# EAGLE design Relay (EAGLE 6.4)
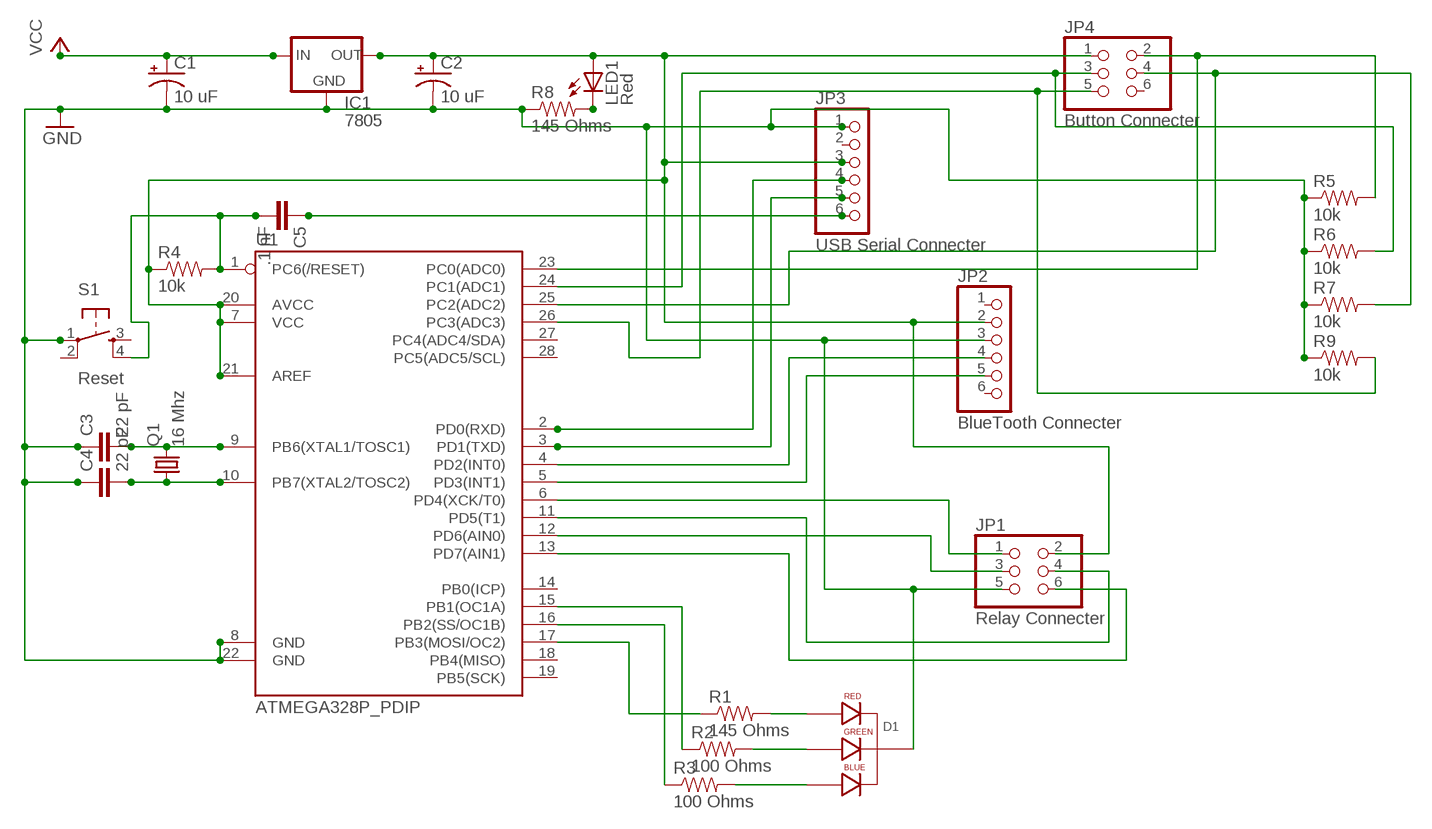
[diagram p0: schematic, sheet 1]

## Parts
C1  10 uF  CAP_POLPTH2  [CPOL-RADIAL-10UF-25V]
C2  10 uF  CAP_POLPTH2  [CPOL-RADIAL-10UF-25V]
C3  22 pF  CAPPTH2  [CAP-PTH-SMALL2]
C4  22 pF  CAPPTH2  [CAP-PTH-SMALL2]
C5  .1 nF  CAPPTH2  [CAP-PTH-SMALL2]
D1  LED-RGB-CC-THRUCLEAR  [LED-RGB-THRU]
IC1  7805  78XXS  [78XXS]
JP1  Relay Connecter  PINHD-2X3  [2X03]
JP2  BlueTooth Connecter  PINHD-1X6  [1X06]
JP3  USB Serial Connecter  PINHD-1X6  [1X06]
JP4  Button Connecter  PINHD-2X3  [2X03]
LED1  Red  LED3MM  [LED3MM]
Q1  16 Mhz  CRYSTALHC49S  [HC49/S]
R1  145 Ohms  RESISTORPTH-1/4W  [AXIAL-0.4]
R2  100 Ohms  RESISTORPTH-1/4W  [AXIAL-0.4]
R3  100 Ohms  RESISTORPTH-1/4W  [AXIAL-0.4]
R4  10k  10KOHM1/10W1%(0603)  [0402-RES]
R5  10k  10KOHM1/10W1%(0603)  [0402-RES]
R6  10k  10KOHM1/10W1%(0603)  [0402-RES]
R7  10k  10KOHM1/10W1%(0603)  [0402-RES]
R8  145 Ohms  RESISTORPTH-1/4W  [AXIAL-0.4]
R9  10k  10KOHM1/10W1%(0603)  [0402-RES]
S1  Reset  TAC_SWITCHPTH  [TACTILE-PTH]
U1  ATMEGA328P_PDIP  [DIL28-3]

## Nets
GND: C1.2(-) C2.2(-) C3.1 C4.1 D1.2(CATHODE) IC1.GND JP1.5 JP2.3 JP3.1 R5.1 R6.1 R7.1 R8.P$1 R9.1 S1.1 U1.8(GND) U1.22(GND)
N$1: C2.1(+) IC1.OUT JP1.2 JP2.2 JP3.3 JP4.1 LED1.A R4.1 U1.7(VCC) U1.20(AVCC) U1.21(AREF)
N$2: LED1.K(C) R8.P$2
N$3: C5.2 R4.2 S1.4 U1.1(PC6(/RESET))
N$4: C3.2 Q1.2 U1.9(PB6(XTAL1/TOSC1))
N$5: C4.2 Q1.1 U1.10(PB7(XTAL2/TOSC2))
N$6: JP3.4 U1.2(PD0(RXD))
N$7: JP3.5 U1.3(PD1(TXD))
N$9: JP2.4 U1.4(PD2(INT0))
N$10: JP2.5 U1.5(PD3(INT1))
N$11: JP1.1 U1.6(PD4(XCK/T0))
N$12: JP1.4 U1.11(PD5(T1))
N$13: JP1.3 U1.12(PD6(AIN0))
N$14: JP1.6 U1.13(PD7(AIN1))
N$15: D1.1(RED_CATHODE) R1.P$2
N$16: D1.3(GREEN_CATHODE) R2.P$2
N$17: D1.4(BLUE_CATHODE) R3.P$2
N$18: R1.P$1 U1.17(PB3(MOSI/OC2))
N$19: R2.P$1 U1.15(PB1(OC1A))
N$20: R3.P$1 U1.16(PB2(SS/OC1B))
N$21: JP4.2 R5.2 U1.23(PC0(ADC0))
N$22: JP4.3 R6.2 U1.24(PC1(ADC1))
N$23: JP4.4 R7.2 U1.25(PC2(ADC2))
N$24: JP4.5 R9.2 U1.26(PC3(ADC3))
N$25: C5.1 JP3.6
VCC: C1.1(+) IC1.IN
Unconnected: JP2.1 JP2.6 JP3.2 JP4.6 S1.2 S1.3 U1.14(PB0(ICP)) U1.18(PB4(MISO)) U1.19(PB5(SCK)) U1.27(PC4(ADC4/SDA)) U1.28(PC5(ADC5/SCL))

## Library data of the parts
C1 C2 = SparkFun-Capacitors:CAP_POL: Capacitor Polarized These are standard SMD and PTH capacitors. Normally 10uF, 47uF, and 100uF in electrolytic and tantalum varieties. Always verify the external diameter of the through hole cap, it varies with capacity, voltage, and manufacturer. The EIA devices should be standard.
C3-C5 = SparkFun-Capacitors:CAP: Capacitor Standard 0603 ceramic capacitor, and 0.1" leaded capacitor.
D1 = SparkFun-LED:LED-RGB-CC-THRU: RGB Through-hole common cathode LED SparkFun Storefront: COM-00105 (Clear) COM-09264 (Diffuse); PROD_ID: DIO-08418
IC1 = v-reg:78XXS: VOLTAGE REGULATOR
JP1 JP4 = SparkFun-Connectors:PINHD-2X3: PIN HEADER
JP2 JP3 = pinhead:PINHD-1X6: PIN HEADER
LED1 = led:LED: LED OSRAM: - CHIPLED LG R971, LG N971, LY N971, LG Q971, LY Q971, LO R971, LY R971 LH N974, LH R974 LS Q976, LO Q976, LY Q976 LO Q996 - Hyper CHIPLED LW Q18S LB Q993, LB Q99A, LB R99A - SideLED LS A670, LO A670, LY A670, LG A670, LP A670 LB A673, LV A673, LT A673, LW A673 LH A674 LY A675 LS A676, LA A676, LO A676, LY A676, LW A676 LS A679, LY A679, LG A679 - Hyper Micro SIDELED® LS Y876, LA Y876, LO Y876, LY Y876 LT Y87S - SmartLED LW L88C, LW L88S LB L89C, LB L89S, LG L890 LS L89K, LO L89K, LY L89K LS L896, LA L896, LO L896, LY L896 - TOPLED LS T670, LO T670, LY T670, LG T670, LP T670 LSG T670, LSP T670, LSY T670, LOP T670, LYG T670 LG T671, LOG T671, LSG T671 LB T673, LV T673, LT T673, LW T673 LH T674 LS T676, LA T676, LO T676, LY T676, LB T676, LH T676, LSB T676, LW T676 LB T67C, LV T67C, LT T67C, LS T67K, LO T67K, LY T67K, LW E67C LS E67B, LA E67B, LO E67B, LY E67B, LB E67C, LV E67C, LT E67C LW T67C LS T679, LY T679, LG T679 LS T770, LO T770, LY T770, LG T770, LP T770 LB T773, LV T773, LT T773, LW T773 LH T774 LS E675, LA E675, LY E675, LS T675 LS T776, LA T776, LO T776, LY T776, LB T776 LHGB T686 LT T68C, LB T68C - Hyper Mini TOPLED® LB M676 - Mini TOPLED Santana® LG M470 LS M47K, LO M47K, LY M47K Source: http://www.osram.convergy.de LUXEON: - LUMILED® LXK2-PW12-R00, LXK2-PW12-S00, LXK2-PW14-U00, LXK2-PW14-V00 LXK2-PM12-R00, LXK2-PM12-S00, LXK2-PM14-U00 LXK2-PE12-Q00, LXK2-PE12-R00, LXK2-PE12-S00, LXK2-PE14-T00, LXK2-PE14-U00 LXK2-PB12-K00, LXK2-PB12-L00, LXK2-PB12-M00, LXK2-PB14-N00, LXK2-PB14-P00, LXK2-PB14-Q00 LXK2-PR12-L00, LXK2-PR12-M00, LXK2-PR14-Q00, LXK2-PR14-R00 LXK2-PD12-Q00, LXK2-PD12-R00, LXK2-PD12-S00 LXK2-PH12-R00, LXK2-PH12-S00 LXK2-PL12-P00, LXK2-PL12-Q00, LXK2-PL12-R00 Source: www.luxeon.com KINGBRIGHT: KA-3528ASYC Source: www.kingbright.com
Q1 = crystal:CRYSTAL: CRYSTAL; OC_FARNELL: 1667008; OC_NEWARK: unknown
R1-R3 R8 = SparkFun-Resistors:RESISTOR: Resistor Basic schematic elements and footprints for 0603, 1206, and PTH resistors.
R4-R7 R9 = SparkFun-Resistors:10KOHM1/10W1%(0603): RES-00824; PROD_ID: RES-00824
S1 = SparkFun-Electromechanical:TAC_SWITCH: Momentary Switch Button commonly used for reset or general input. Spark Fun Electronics SKU : COM-00097 SMT- SWCH-08247
U1 = SparkFun-DigitalIC:ATMEGA328P_PDIP: uC used in the Arduino 32kb flash, 1k EEPROM, 2k SRAM This is the through-hole version of this chip.

## Board
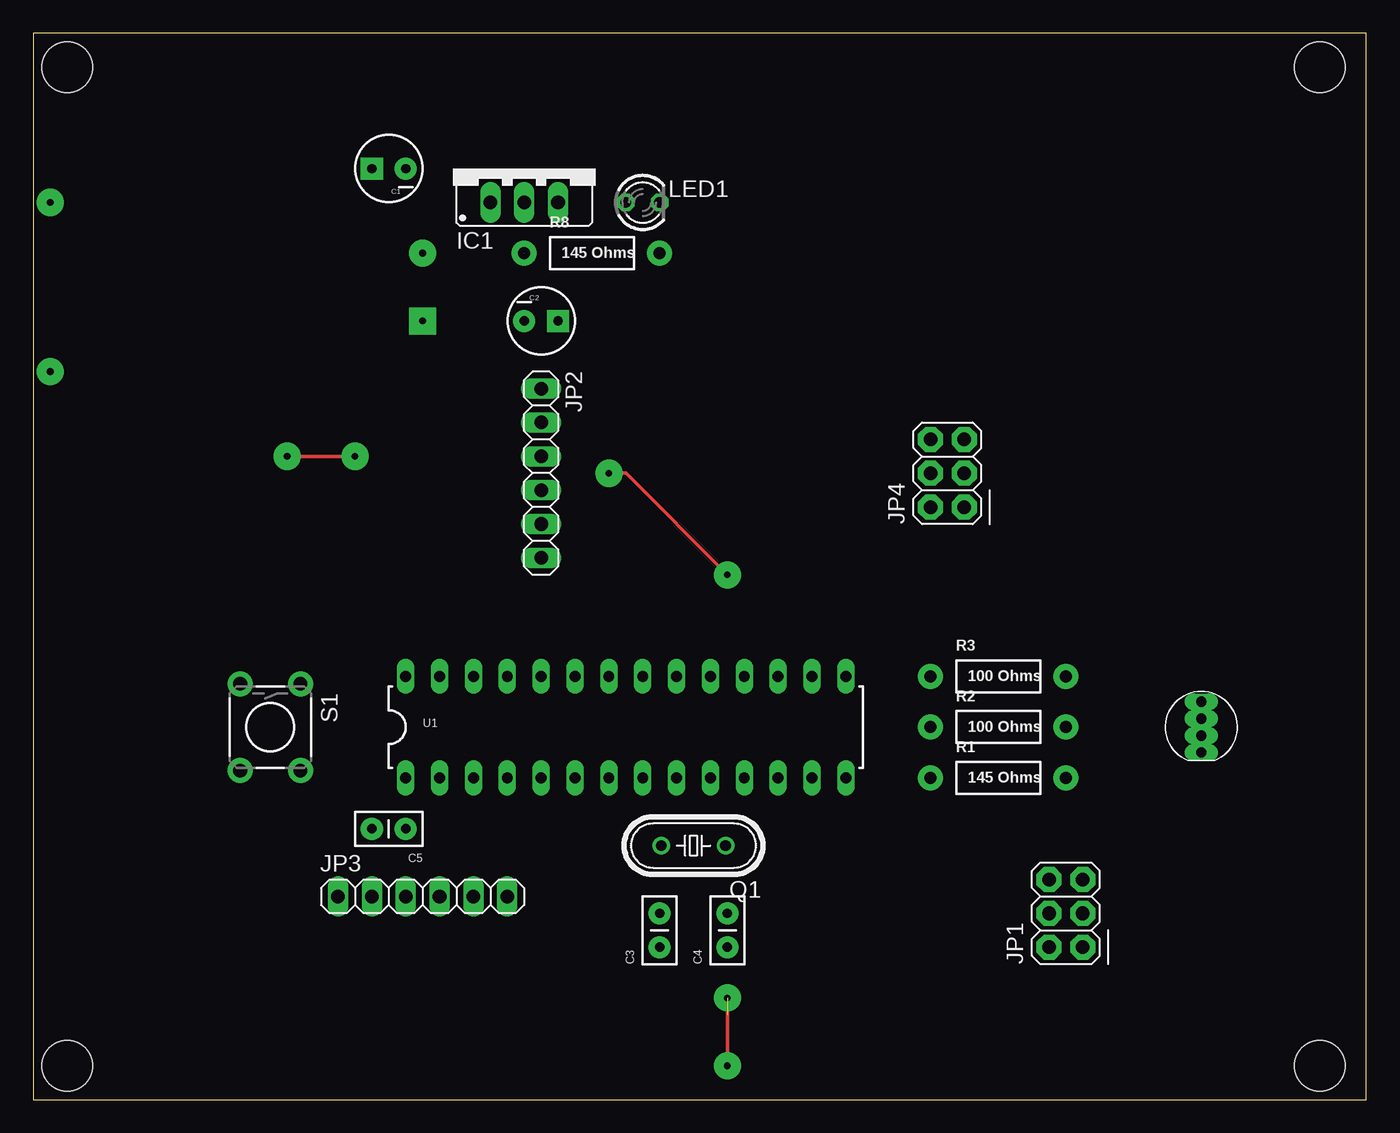
[diagram p1: board, top side]
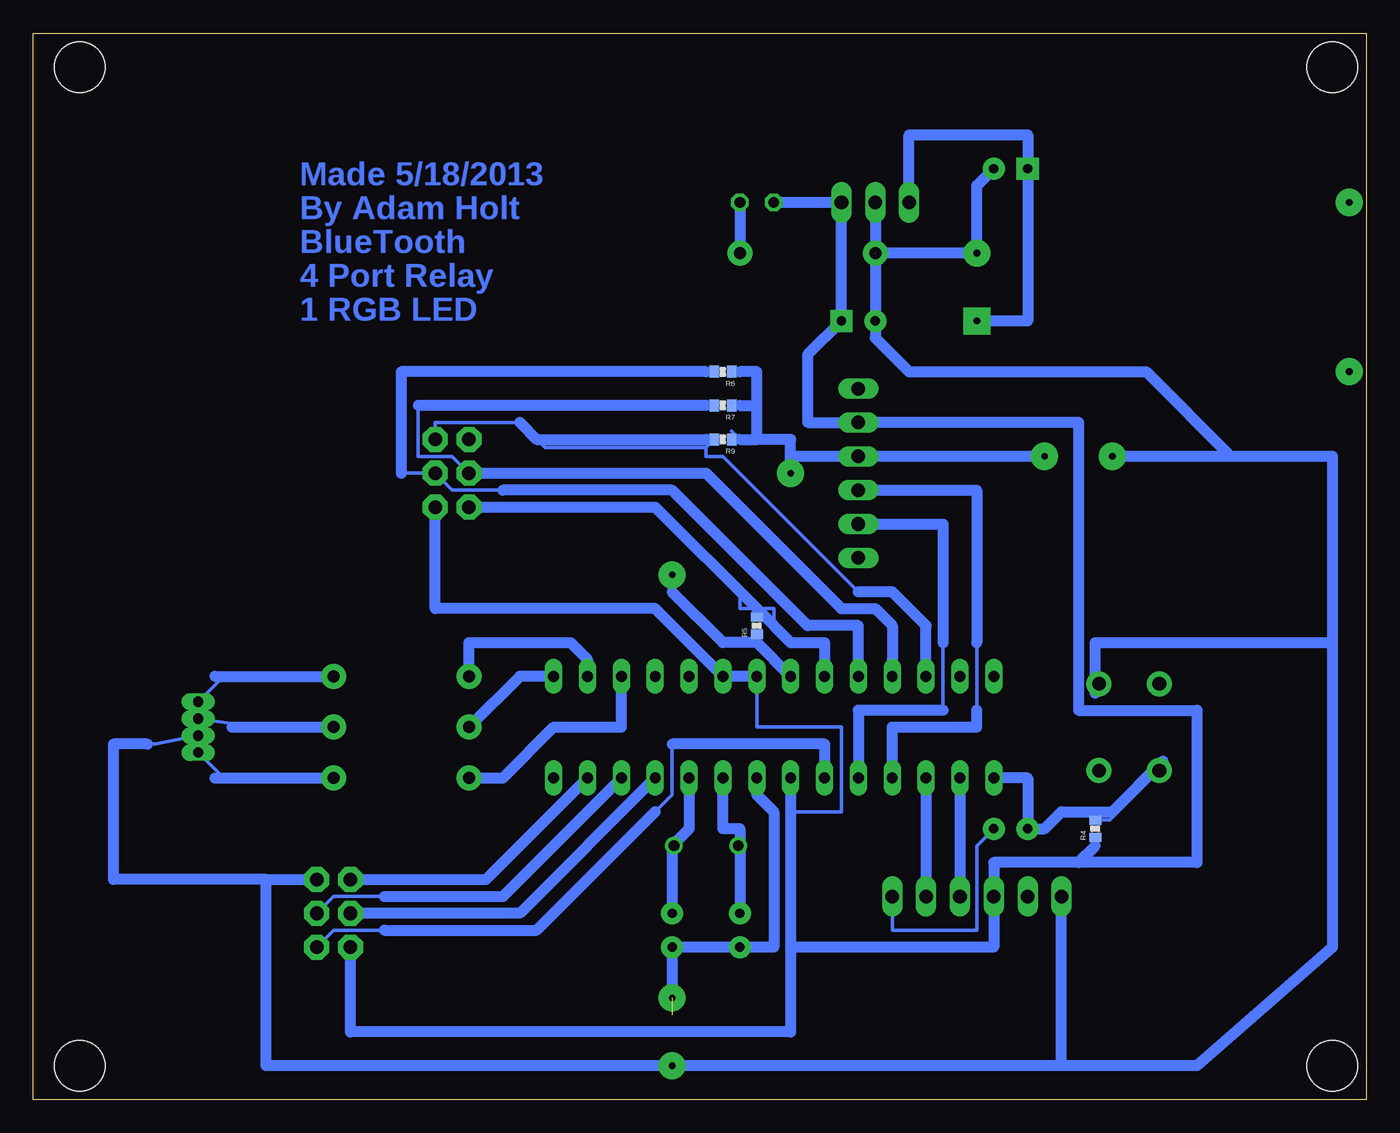
[diagram p2: board, bottom side, seen from below]

Size 100 x 80 mm. Coordinates in mm from the lower left corner, seen from the top.
Outline: 0,0 100,0 100,80 0,80 0,0
Copper layers (1*16): Top 0.035mm / dielectric 1.5mm / Bottom 0.035mm
Design rules "default": minimum track width 10mil, minimum drill 24mil, track to track 8mil, track to pad 8mil, pad to pad 8mil, via to via 8mil, smd to smd 8mil, copper to edge 40mil, drill to drill 8mil, minimum pad ring 10mil, minimum via ring 8mil, stop-mask expansion 4mil, vias tented up to drill 0mil, thermal gap 10mil
Holes 3.81 mm at 2.54,77.47 96.52,77.47 96.52,2.54 2.54,2.54

### Footprints (pad centres in the part's own frame; a part is rotated, then mirrored left to right if it is on the bottom)
CPOL-RADIAL-10UF-25V = drill 0.7 pad 1.651 square: 1 1.27,0 | drill 0.7 pad 1.651: 2 -1.27,0
CAP-PTH-SMALL2 = drill 0.7 pad 1.651: 1 0,0; 2 2.54,0
LED-RGB-THRU = drill 0.762 pad 0.889 long: 1 1.905,0; 2 0.635,0; 3 -0.635,0; 4 -1.905,0
78XXS = drill 1.016 long: GND 0,-2.54; IN -2.54,-2.54; OUT 2.54,-2.54
2X03 = drill 1.016 pad 1.88 octagon: 1 -2.54,-1.27; 2 -2.54,1.27; 3 0,-1.27; 4 0,1.27; 5 2.54,-1.27; 6 2.54,1.27
1X06 = drill 1.016 long: 1 -6.35,0; 2 -3.81,0; 3 -1.27,0; 4 1.27,0; 5 3.81,0; 6 6.35,0
LED3MM = drill 0.813 octagon: A -1.27,0; K 1.27,0
HC49/S = drill 0.813: 1 -2.413,0; 2 2.413,0
AXIAL-0.4 = drill 0.9 pad 1.88: P$1 -5.08,0; P$2 5.08,0
0402-RES = smd 0.7 x 0.9: 1 -0.65,0; 2 0.65,0
TACTILE-PTH = drill 1.016 pad 1.88: 1 -3.251,2.261; 2 3.251,2.261; 3 -3.251,-2.261; 4 3.251,-2.261
DIL28-3 = drill 0.813 long: 1 -16.51,-3.81; 2 -13.97,-3.81; 3 -11.43,-3.81; 4 -8.89,-3.81; 5 -6.35,-3.81; 6 -3.81,-3.81; 7 -1.27,-3.81; 8 1.27,-3.81; 9 3.81,-3.81; 10 6.35,-3.81; 11 8.89,-3.81; 12 11.43,-3.81; 13 13.97,-3.81; 14 16.51,-3.81; 15 16.51,3.81; 16 13.97,3.81; 17 11.43,3.81; 18 8.89,3.81; 19 6.35,3.81; 20 3.81,3.81; 21 1.27,3.81; 22 -1.27,3.81; 23 -3.81,3.81; 24 -6.35,3.81; 25 -8.89,3.81; 26 -11.43,3.81; 27 -13.97,3.81; 28 -16.51,3.81

### Placement (x,y rotation side)
C1  26.67,69.85 180 top
C2  38.1,58.42 0 top
C3  46.99,11.43 90 top
C4  52.07,11.43 90 top
C5  27.94,20.32 180 top
D1  87.63,27.94 270 top
IC1  36.83,69.85 0 top
JP1  77.47,13.97 90 top
JP2  38.1,46.99 270 top
JP3  29.21,15.24 0 top
JP4  68.58,46.99 90 top
LED1  45.72,67.31 0 top
Q1  49.53,19.05 180 top
R1  72.39,24.13 0 top
R2  72.39,27.94 0 top
R3  72.39,31.75 0 top
R4  20.32,20.32 90 bottom
R5  45.72,35.56 90 bottom
R6  48.26,54.61 180 bottom
R7  48.26,52.07 180 bottom
R8  41.91,63.5 0 top
R9  48.26,49.53 180 bottom
S1  17.78,27.94 270 top
U1  44.45,27.94 0 top

### Tracks (layer width: path | path; a pad name or v marks a point on that pad's centre or on a via)
GND  (via drill 0.51 pad 2.03)  (2 unrouted)
  Top 0.254: v24.13,48.26 v19.05,48.26 | v52.07,2.54 v52.07,7.62 | v43.18,46.99 44.45,46.99 v52.07,39.37
  Bottom 0.254: S1.1 20.04,34.01 20.32,34.29 | 91.44,26.67 90.81,26.67 D1.2 | R9.1 46.99,49.53 47.61,50.15 | 40.64,48.26 JP2.3 | R7.1 46.99,52.07 | R6.1 46.99,54.61 | R5.1 45.72,34.29 | v52.07,39.37 52.07,38.1 | 43.18,48.26 43.18,49.53
  Bottom 0.813: 10.16,48.26 2.54,48.26 2.54,34.29 | 10.16,48.26 v19.05,48.26 | v24.13,48.26 JP2.3 43.18,48.26 v43.18,46.99 43.18,49.53 45.72,49.53 | 46.99,49.53 45.72,49.53 | 45.72,49.53 45.72,52.07 | 46.99,52.07 45.72,52.07 | 45.72,52.07 45.72,54.61 46.99,54.61 | 20.32,30.48 20.32,34.29 2.54,34.29 | 2.54,34.29 2.54,11.43 12.7,2.54 22.86,2.54 | 22.86,2.54 JP3.1 | 22.86,2.54 v52.07,2.54 82.55,2.54 82.55,16.51 | 82.55,16.51 JP1.5 | U1.8 45.72,22.86 44.45,21.59 44.45,11.43 C3.1 C4.1 v52.07,7.62 | 82.55,16.51 93.98,16.51 93.98,26.67 91.44,26.67 | U1.22 45.72,34.29 48.26,34.29 52.07,38.1 | IC1.GND R8.P$1 | R8.P$1 C2.2 36.83,57.15 34.29,54.61 16.51,54.61 10.16,48.26 | C1.2 29.21,68.58 v29.21,63.5 R8.P$1
N$1
  Bottom 0.254: 27.94,17.78 JP3.3 27.94,11.43 | R4.1 20.32,19.05 | 43.18,11.43 43.18,21.59 | 43.18,21.59 U1.7 | U1.21 45.72,27.94 39.37,27.94 39.37,21.59 43.18,21.59
  Bottom 0.813: 21.59,17.78 12.7,17.78 12.7,29.21 21.59,29.21 21.59,50.8 JP2.2 41.91,50.8 41.91,55.88 C2.1 IC1.OUT LED1.A | 21.59,17.78 20.32,19.05 | 21.59,17.78 27.94,17.78 27.94,11.43 43.18,11.43 | U1.7 43.18,11.43 | 43.18,11.43 43.18,5.08 76.2,5.08 JP1.2 | U1.21 U1.20 53.34,36.83 69.85,36.83 JP4.1
N$2
  Bottom 0.813: LED1.K R8.P$2
N$3
  Bottom 0.254: S1.4 19.24,20.97 R4.2 20.94,21.59 22.86,21.59
  Bottom 0.813: 15.24,25.4 19.05,21.59 22.86,21.59 24.13,20.32 C5.2 25.4,24.13 U1.1
N$4
  Bottom 0.254: 48.26,20.32 47.12,20.32 Q1.2 47.12,14.1 C3.2
  Bottom 0.813: C3.2 46.99,20.32 48.26,20.32 U1.9
N$5
  Bottom 0.254: 50.8,20.32 50.8,20.19 Q1.1 52.07,18.92 C4.2
  Bottom 0.813: U1.10 50.8,20.32 52.07,19.05 C4.2
N$6
  Bottom 0.813: U1.2 JP3.4
N$7
  Bottom 0.813: U1.3 JP3.5
N$8  (via drill 0.51 pad 2.03)
  other vias: 1.27,67.31
N$9
  Bottom 0.254: 29.21,29.21 29.21,34.29
  Bottom 0.813: JP2.4 29.21,45.72 29.21,34.29 | U1.4 35.56,27.94 29.21,27.94 29.21,29.21
N$10
  Bottom 0.254: 31.75,29.21 31.75,34.29
  Bottom 0.813: JP2.5 31.75,43.18 31.75,34.29 | 31.75,29.21 38.1,29.21 U1.5
N$11
  Bottom 0.254: 52.07,26.67 52.07,22.86 53.34,21.59 | 73.66,12.7 77.47,12.7 JP1.1
  Bottom 0.813: 73.66,12.7 62.23,12.7 53.34,21.59 | 52.07,26.67 40.64,26.67 U1.6
N$12
  Bottom 0.813: U1.11 63.5,13.97 JP1.4
N$13
  Bottom 0.254: 73.66,15.24 77.47,15.24 JP1.3
  Bottom 0.813: 73.66,15.24 64.77,15.24 U1.12
N$14
  Bottom 0.813: JP1.6 66.04,16.51 U1.13
N$15
  Bottom 0.254: R1.P$2 85.72,24.13 D1.1
  Bottom 0.813: 86.36,24.13 R1.P$2
N$16
  Bottom 0.254: R2.P$2 83.19,27.94 D1.3
  Bottom 0.813: 85.09,27.94 R2.P$2
N$17
  Bottom 0.254: R3.P$2 85.72,31.75 D1.4
  Bottom 0.813: 86.36,31.75 R3.P$2
N$18
  Bottom 0.813: R1.P$1 64.77,24.13 60.96,27.94 55.88,27.94 U1.17
N$19
  Bottom 0.813: U1.15 63.5,31.75 R2.P$1
N$20
  Bottom 0.813: R3.P$1 67.31,34.29 59.69,34.29 58.42,33.02 U1.16
N$21
  Bottom 0.254: U1.23 40.64,33.02 | 43.18,34.29 44.45,35.56 44.45,36.83 45.1,36.83 R5.2 45.72,36.83 46.99,36.83 46.99,38.1 53.34,44.45
  Bottom 0.813: JP4.2 53.34,44.45 45.72,36.83 43.18,34.29 40.64,34.29 40.64,33.02
N$22
  Bottom 0.254: R6.2 49.53,54.61 | 72.39,46.99 JP4.3 68.58,45.72 64.77,45.72
  Bottom 0.813: 49.53,54.61 72.39,54.61 72.39,46.99 | U1.24 38.1,35.56 41.91,35.56 52.07,45.72 64.77,45.72
N$23
  Bottom 0.254: R7.2 49.53,52.07 | 35.56,33.02 U1.25 | 71.12,52.07 71.12,48.26 68.58,48.26 JP4.4
  Bottom 0.813: 49.53,52.07 71.12,52.07 | JP4.4 49.53,46.99 39.37,36.83 36.83,36.83 35.56,35.56 35.56,33.02
N$24
  Bottom 0.254: 38.1,38.1 48.26,48.26 49.53,48.26 49.53,48.91 | 49.53,48.91 R9.2 | 49.53,48.91 61.61,48.91 62.23,49.53 | 63.5,50.8 69.85,50.8 JP4.5
  Bottom 0.813: 63.5,50.8 62.23,49.53 49.53,49.53 | U1.26 33.02,35.56 35.56,38.1 38.1,38.1
N$25
  Bottom 0.254: C5.1 29.21,19.05 29.21,12.7 35.56,12.7 JP3.6
N$26  (via drill 0.51 pad 2.03)
  other vias: 1.27,54.61
VCC  (via drill 0.51 pad 2.03)
  Bottom 0.813: IC1.IN 34.29,72.39 25.4,72.39 C1.1 25.4,58.42 v29.21,58.42

### Text on the board
Bottom: Made 5/18/2013 | By Adam Holt | BlueTooth | 4 Port Relay | 1 RGB LED